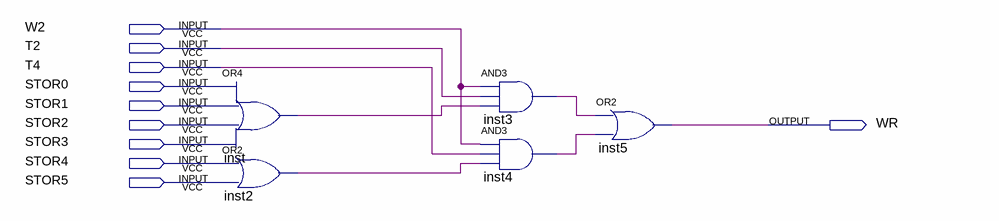
[diagram p0: schematic sheet]
// Quartus schematic WR.bdf as structural Verilog: 5 symbols, 10 pins
module WR (
  input  W2,
  input  T2,
  input  T4,
  input  STOR0,
  input  STOR1,
  input  STOR2,
  input  STOR3,
  input  STOR4,
  input  STOR5,
  output WR
);

  wire inst2_out, inst3_out, inst4_out, inst_out;

  or inst (inst_out, STOR0, STOR1, STOR2, STOR3);
  or inst2 (inst2_out, STOR4, STOR5);
  and inst3 (inst3_out, W2, T2, inst_out);
  and inst4 (inst4_out, W2, T4, inst2_out);
  or inst5 (WR, inst3_out, inst4_out);
endmodule
